# Altium schematic sheet MCU.SchDoc: MCU
size A3; Organization: ORGANIZATION; Address1: ADDRESS 1; Address2: ADDRESS 2; Address3: ADDRESS 3; Address4: ADDRESS 4; Revision: -; SheetNumber: 3; SheetTotal: 11; ENG_APP_DATE: --/--/--; DSN_APP_DATE: --/--/--; CHK_APP_DATE: --/--/--
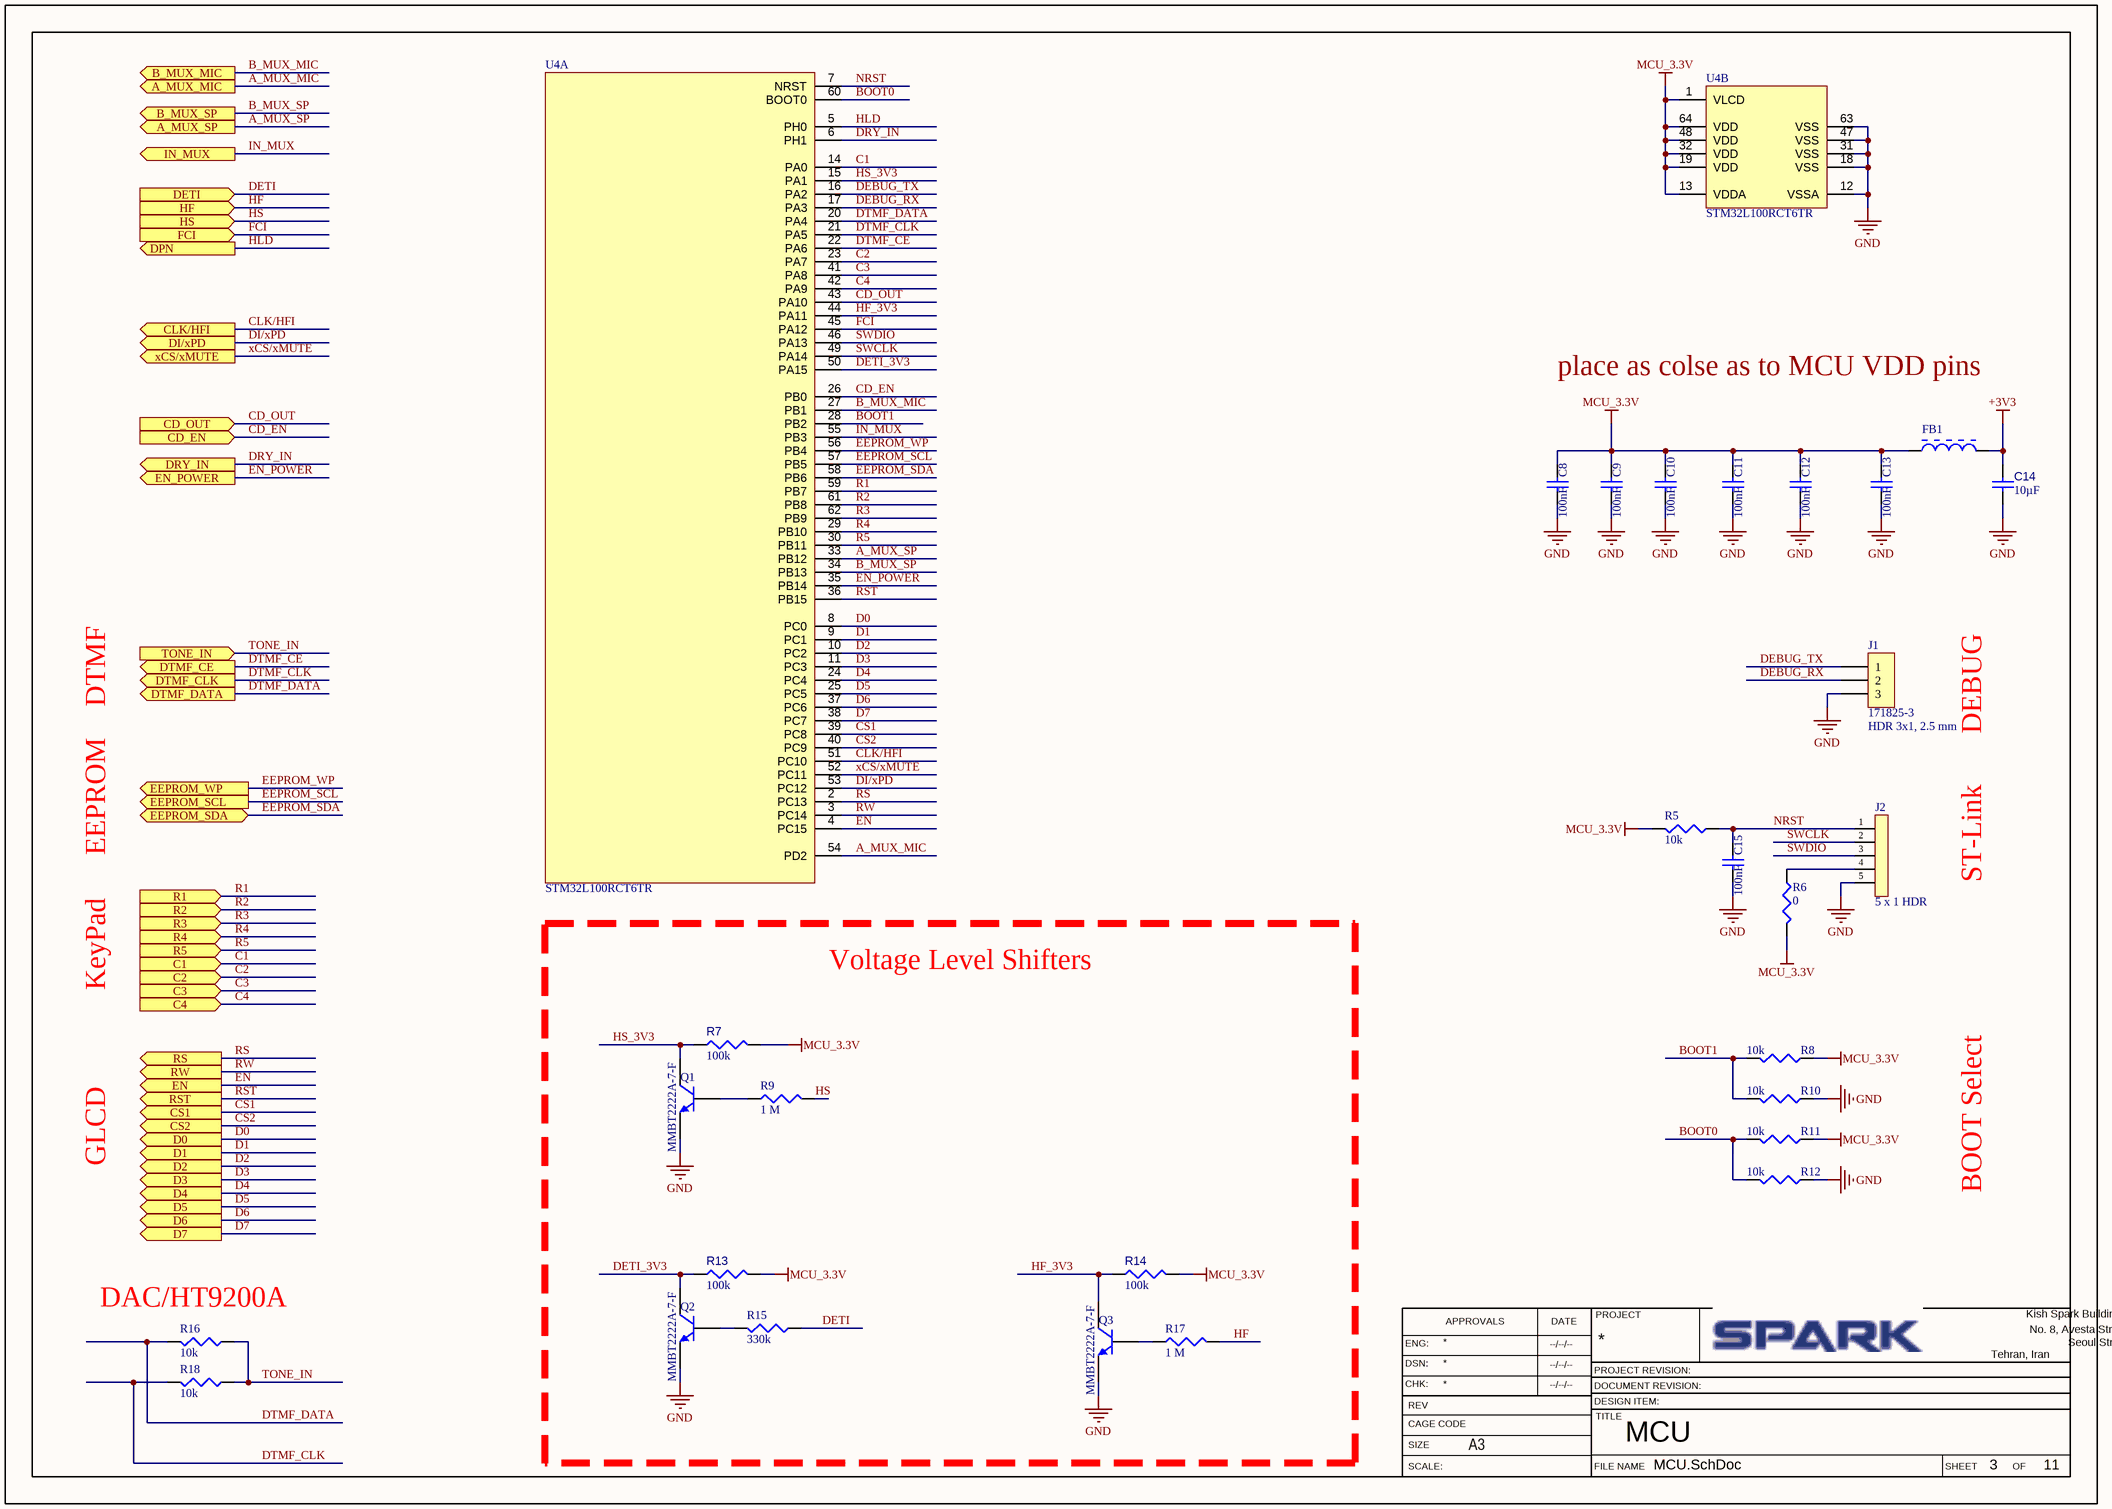
[diagram p0: MCU.SchDoc]

## Parts
C8  value 100nF  [C0603]  (hidden comment: CC0603KRX7R8BB104)
C9  value 100nF  [C0603]  (hidden comment: CC0603KRX7R8BB104)
C10  value 100nF  [C0603]  (hidden comment: CC0603KRX7R8BB104)
C11  value 100nF  [C0603]  (hidden comment: CC0603KRX7R8BB104)
C12  value 100nF  [C0603]  (hidden comment: CC0603KRX7R8BB104)
C13  value 100nF  [C0603]  (hidden comment: CC0603KRX7R8BB104)
C14  value 10µF  [0805]  (hidden comment: C0805C106K9PACTU)
C15  value 100nF  [C0603]  (hidden comment: CC0603KRX7R8BB104)
FB1  CMP-006-00051-1  [R0603]  (value not drawn)
J1  171825-3  value HDR 3x1, 2.5 mm  [HDR_MALE_1x3_2.5MM_AMP EI_VERT]
J2  5 x 1 HDR  [HDR_male_1x5_2.54mm]
Q1  MMBT2222A-7-F  [SOT23127P600-8N]
Q2  MMBT2222A-7-F  [SOT23127P600-8N]
Q3  MMBT2222A-7-F  [SOT23127P600-8N]
R5  value 10k  [R0603]  (hidden comment: CRCW060310K0JNEA)
R6  value 0  [0805]  (hidden comment: CMP-009-00305-1)
R7  value 100k  [R0805]  (hidden comment: RC0805FR-07100KL)
R8  value 10k  [R0603]  (hidden comment: CRCW060310K0JNEA)
R9  value 1 M  [0805]  (hidden comment: CMP-009-00300-1)
R10  value 10k  [R0603]  (hidden comment: CRCW060310K0JNEA)
R11  value 10k  [R0603]  (hidden comment: CRCW060310K0JNEA)
R12  value 10k  [R0603]  (hidden comment: CRCW060310K0JNEA)
R13  value 100k  [R0805]  (hidden comment: RC0805FR-07100KL)
R14  value 100k  [R0805]  (hidden comment: RC0805FR-07100KL)
R15  value 330k  [0805]  (hidden comment: CMP-009-00308-1)
R16  value 10k  [R0603]  (hidden comment: CRCW060310K0JNEA)
R17  value 1 M  [0805]  (hidden comment: CMP-009-00300-1)
R18  value 10k  [R0603]  (hidden comment: CRCW060310K0JNEA)
U4  STM32L100RCT6TR  [STM32L100RCT6TR-Footprint-1]  (parts A,B of 2)

## Blocks framed on the sheet
Voltage Level Shifters: Q1-Q3 R7 R9 R13-R15 R17

## Ports
A_MUX_MIC (out), A_MUX_SP (out), B_MUX_MIC (out), B_MUX_SP (out), C1 (in), C2 (in), C3 (in), C4 (in), CD_EN (in), CD_OUT (in), CLK/HFI (out), CS1 (out), CS2 (out), D0 (out), D1 (out), D2 (out), D3 (out), D4 (out), D5 (out), D6 (out), D7 (out), DETI (in), DI/xPD (out), DPN (out), DRY_IN (out), DTMF_CE (out), DTMF_CLK (out), DTMF_DATA (out), EEPROM_SCL (out), EEPROM_SDA (bidir), EEPROM_WP (out), EN (out), EN_POWER (out), FCI (in), HF (in), HS (in), IN_MUX (out), R1 (in), R2 (in), R3 (in), R4 (in), R5 (in), RS (out), RST (out), RW (out), TONE_IN (in), xCS/xMUTE (out)

## Nets
+3V3: C14.1 FB1.2
GND: C8.2 C9.2 C10.2 C11.2 C12.2 C13.2 C14.2 C15.2 J1.3 J2.5 Q1.1(E) Q2.1(E) Q3.1(E) R10.1 R12.1 U4.12(VSSA) U4.18(VSS) U4.31(VSS) U4.47(VSS) U4.63(VSS)
MCU_3.3V: C8.1 C9.1 C10.1 C11.1 C12.1 C13.1 FB1.1 R5.2 R6.2 R7.2 R8.1 R11.1 R13.2 R14.2 U4.1(VLCD) U4.13(VDDA) U4.19(VDD) U4.32(VDD) U4.48(VDD) U4.64(VDD)
A_MUX_MIC: U4.54(PD2) ; port A_MUX_MIC
A_MUX_SP: U4.33(PB12) ; port A_MUX_SP
B_MUX_MIC: U4.27(PB1) ; port B_MUX_MIC
B_MUX_SP: U4.34(PB13) ; port B_MUX_SP
BOOT0: R11.2 R12.2 U4.60(BOOT0)
BOOT1: R8.2 R10.2 U4.28(PB2)
C1: U4.14(PA0) ; port C1
C2: U4.23(PA7) ; port C2
C3: U4.41(PA8) ; port C3
C4: U4.42(PA9) ; port C4
CD_EN: U4.26(PB0) ; port CD_EN
CD_OUT: U4.43(PA10) ; port CD_OUT
CLK/HFI: U4.51(PC10) ; port CLK/HFI
CS1: U4.39(PC8) ; port CS1
CS2: U4.40(PC9) ; port CS2
D0: U4.8(PC0) ; port D0
D1: U4.9(PC1) ; port D1
D2: U4.10(PC2) ; port D2
D3: U4.11(PC3) ; port D3
D4: U4.24(PC4) ; port D4
D5: U4.25(PC5) ; port D5
D6: U4.37(PC6) ; port D6
D7: U4.38(PC7) ; port D7
DEBUG_RX: J1.2 U4.17(PA3)
DEBUG_TX: J1.1 U4.16(PA2)
DETI: R15.1 ; port DETI
DETI_3V3: Q2.3(C) R13.1 U4.50(PA15)
DI/xPD: U4.53(PC12) ; port DI/xPD
DRY_IN: U4.6(PH1) ; port DRY_IN
DTMF_CE: U4.22(PA6) ; port DTMF_CE
DTMF_CLK: R18.2 U4.21(PA5) ; port DTMF_CLK
DTMF_DATA: R16.2 U4.20(PA4) ; port DTMF_DATA
EEPROM_SCL: U4.57(PB5) ; port EEPROM_SCL
EEPROM_SDA: U4.58(PB6) ; port EEPROM_SDA
EEPROM_WP: U4.56(PB4) ; port EEPROM_WP
EN: U4.4(PC15) ; port EN
EN_POWER: U4.35(PB14) ; port EN_POWER
FCI: U4.45(PA12) ; port FCI
HF: R17.2 ; port HF
HF_3V3: Q3.3(C) R14.1 U4.44(PA11)
HLD: U4.5(PH0) ; port DPN
HS: R9.2 ; port HS
HS_3V3: Q1.3(C) R7.1 U4.15(PA1)
IN_MUX: U4.55(PB3) ; port IN_MUX
NRST: C15.1 J2.1 R5.1 U4.7(NRST)
R1: U4.59(PB7) ; port R1
R2: U4.61(PB8) ; port R2
R3: U4.62(PB9) ; port R3
R4: U4.29(PB10) ; port R4
R5: U4.30(PB11) ; port R5
RS: U4.2(PC13) ; port RS
RST: U4.36(PB15) ; port RST
RW: U4.3(PC14) ; port RW
SWCLK: J2.2 U4.49(PA14)
SWDIO: J2.3 U4.46(PA13)
TONE_IN: R16.1 R18.1 ; port TONE_IN
xCS/xMUTE: U4.52(PC11) ; port xCS/xMUTE
NetJ2_4: J2.4 R6.1
NetQ1_2: Q1.2(B) R9.1
NetQ2_2: Q2.2(B) R15.2
NetQ3_2: Q3.2(B) R17.1

## Notes on the sheet
- place as colse as to MCU VDD pins
- DTMF
- DEBUG
- EEPROM
- ST-Link
- KeyPad
- GLCD
- BOOT Select
- (near R16) DAC/HT9200A
- APPROVALS
- DATE
- PROJECT
- Kish Spark Building
- No. 8, Avesta Street
- ENG:
- DSN:
- CHK:
- PROJECT REVISION:
- DESIGN ITEM:
- DOCUMENT REVISION:
- Tehran, Iran
- Seoul Street, Sheikh Bahaie
- SIZE
- REV
- SCALE:
- CAGE CODE
- A3
- FILE NAME
- TITLE
- SHEET
- OF

## Library data of the parts
C8-C13 C15 = CMP-001-00108-2: YAGEO - CC0603KRX7R8BB104 - CERAMIC CAPACITOR, 0.1UF, 25V, X7R, 10%, 0603, FULL REEL; Case/Package: 0603; Pins: 2; RoHS Compliant: Yes; Min Operating Temperature: -55°C; Max Operating Temperature: 125°C; Voltage Rating: 25V; Tolerance: 10%; Design Item ID: CC0603KRX7R8BB104; Case Code (Metric): 1608; Category: Ceramic Capacitors; Depth: 0.8mm; Dielectric: X7R; Halogen Free: Halogen Free; Height: 0.8mm; Lead Free: Lead Free; Length: 1.6mm; Manufacturer 1: Yageo; Manufacturer Part Number 1: CC0603KRX7R8BB104; Mount: Surface Mount; Package Quantity: 1; Packaging: Tape and Reel; Pricing 1: 1=0.10000, 10=0.05000, 50=0.02720, 100=0.02220, 500=0.01586, 1000=0.01246 (USD); Radiation Hardening: No; REACH SVHC: Unknown; Resistor Type: Ceramic; RoHS: Yes; Series: CC; Source: PTZLib.SchLib; Stock 1: 4053185; Termination: SMD/SMT; Thickness: 0.035inch; Voltage: 25V; Voltage Rating (DC): 25V; Width: 0.8mm; ComponentLink1Description: https://datasheet.ciiva.com/144/mlccorderingcode-144075.pdf?src-supplier=Digi-Key; ComponentLink1URL: https://datasheet.ciiva.com/144/mlccorderingcode-144075.pdf?src-supplier=Digi-Key; ComponentLink2Description: https://datasheet.ciiva.com/11786/0900766b80c10176-11786120.pdf?src-supplier=RSComponents; ComponentLink2URL: https://datasheet.ciiva.com/11786/0900766b80c10176-11786120.pdf?src-supplier=RSComponents; ComponentLink3Description: https://datasheet.ciiva.com/7978/1489800-7978155.pdf?src-supplier=Element14; ComponentLink3URL: https://datasheet.ciiva.com/7978/1489800-7978155.pdf?src-supplier=Element14; ComponentLink4Description: https://datasheet.ciiva.com/28450/1489800-28450584.pdf?src-supplier=Element14; ComponentLink4URL: https://datasheet.ciiva.com/28450/1489800-28450584.pdf?src-supplier=Element14; ComponentLink5Description: https://datasheet.ciiva.com/144/mlccorderingcode-144074.pdf?src-supplier=Digi-Key; ComponentLink5URL: https://datasheet.ciiva.com/144/mlccorderingcode-144074.pdf?src-supplier=Digi-Key; ComponentLink6Description: https://datasheet.ciiva.com/144/mlccorderingcode-144073.pdf?src-supplier=Digi-Key; ComponentLink6URL: https://datasheet.ciiva.com/144/mlccorderingcode-144073.pdf?src-supplier=Digi-Key; ComponentLink7Description: https://datasheet.ciiva.com/13389/upy-gphc-x7r-6-3v-to-50v-8-13389352.pdf?src-supplier=Mouser; ComponentLink7URL: https://datasheet.ciiva.com/13389/upy-gphc-x7r-6-3v-to-50v-8-13389352.pdf?src-supplier=Mouser; ComponentLink8Description: https://datasheet.ciiva.com/11587/upy-gphc-x7r-6-3v-to-50v-8-11587208.pdf?src-supplier=Avnet; ComponentLink8URL: https://datasheet.ciiva.com/11587/upy-gphc-x7r-6-3v-to-50v-8-11587208.pdf?src-supplier=Avnet; ComponentLink9Description: https://datasheet.ciiva.com/26829/getdatasheetpartid-403577-26829431.pdf?src-supplier=Verical; ComponentLink9URL: https://datasheet.ciiva.com/26829/getdatasheetpartid-403577-26829431.pdf?src-supplier=Verical; ComponentLink10Description: https://datasheet.ciiva.com/17434/upy-gphc-x7r-6-3v-to-50v-8-17434263.pdf?src-supplier=Avnet+Europe; ComponentLink10URL: https://datasheet.ciiva.com/17434/upy-gphc-x7r-6-3v-to-50v-8-17434263.pdf?src-supplier=Avnet+Europe
C14 = CMP-001-00180-2: Ceramic Capacitor, 10UF, 6.3V, X5R, 10%, 0805, Full Reel; Manufacturer: KEMET; Dissipation Factor: 5%; Capacitor Type: Ceramic Capacitors; Manufacturer Part Number: C0805C106K9PACTU; Mount: Surface Mount; Case/Package: 0805; Case Code (Metric): 2012; Dielectric Material: Ceramic; Contact Material: Tin; Min Operating Temperature: -55°C; Max Operating Temperature: 85°C; Tolerance: 10%; Voltage Rating (DC): 6.3V; Dielectric: X5R; Packaging: Tape and Reel; Voltage Rating: 6.3V; Series: SMD Comm X5R; Construction: Flat; Length: 2mm; Width: 1.2mm; Height: 1.25mm; Depth: 1.25mm; Lead Pitch: 0.75mm; Radiation Hardening: No; RoHS Compliant: Yes; Lead Free: Lead Free; Reach SVHC Compliant: No; ComponentLink1URL: https://datasheet.ciiva.com/7842/kem-c1006-x5r-smd-7842200.pdf?src-supplier=Element14; ComponentLink1Description: https://datasheet.ciiva.com/7842/kem-c1006-x5r-smd-7842200.pdf?src-supplier=Element14; ComponentLink2URL: https://datasheet.ciiva.com/7842/kem-c1006-x5r-smd-7842201.pdf?src-supplier=Element14; ComponentLink2Description: https://datasheet.ciiva.com/7842/kem-c1006-x5r-smd-7842201.pdf?src-supplier=Element14; ComponentLink3URL: https://datasheet.ciiva.com/7842/40889-7842553.pdf?src-supplier=Element14; ComponentLink3Description: https://datasheet.ciiva.com/7842/40889-7842553.pdf?src-supplier=Element14; ComponentLink4URL: https://datasheet.ciiva.com/7842/40889-7842554.pdf?src-supplier=Element14; ComponentLink4Description: https://datasheet.ciiva.com/7842/40889-7842554.pdf?src-supplier=Element14; ComponentLink5URL: https://datasheet.ciiva.com/18193/getdatasheetpartid-320652-18193500.pdf?src-supplier=Verical; ComponentLink5Description: https://datasheet.ciiva.com/18193/getdatasheetpartid-320652-18193500.pdf?src-supplier=Verical; Pins: 2; Mounting Technology: SMD/SMT
FB1 = CMP-006-00051-1: Ferrite Beads 0603 60ohm; Manufacturer 1: Murata; Manufacturer Part Number 1: BLM18PG471SN1B; Tolerance: 25%; Impedance: 470R; DC Resistance (DCR): 200mR; Current Rating: 1A; RoHS: Yes; Category: Ferrite Beads and Chips; Case/Package: 0603; Min Operating Temperature: -55°C; Max Operating Temperature: 125°C; Package Quantity: 1000; Packaging: Bulk; ComponentLink1URL: http://www.mouser.com/ds/2/281/c31e-794748.pdf?src-supplier=Mouser; ComponentLink1Description: http://www.mouser.com/ds/2/281/c31e-794748.pdf?src-supplier=Mouser; Pins: 2; Design Item ID: BLM18PG471SN1B; Source: PTZLib.SchLib
J1 = CMP-002-00072-2: EI Series 3 Position 2.5 mm Single Row Through Hole Shrouded Header; Manufacturer: TE Connectivity; Connector Type: Plug,Header,Pin; Voltage Rating: 350V; Approvals: UL; Backwall/Post Interruptions: No (Without); Contact Current Rating: 3.5A; Contact Resistance: 20mR; Mating Alignment: Yes (With); Max Voltage Rating (AC): 250V; Max Voltage Rating (DC): 350.25kV; Number of Contacts: 3; PCB Mount Retention: Without; PCB Mounting Orientation: Vertical; PCB Thickness: 0.063inch; Pitch: 2.5mm; Plating Thickness: 0.8um; Tail Length: 0.142inch; Case/Package: 1000; RoHS Compliant: Yes; Min Operating Temperature: -20°C; Max Operating Temperature: 95°C; Design Item ID: 171825-3; Category: Connectors; Color: Natural; Contact Gender: Male; Contact Material: Brass; Contact Mating Length: 7.5mm; Contact Plating: Copper,Tin; Contact Retention: No (Without); Contact Shape: Square; Contact Type: Male Pin; Current Rating: 3.5A; Depth: 4.9mm; Flammability Rating: UL94 V-0; Height: 0.409inch; Housing Color: Natural; Housing Material: Nylon; Insulation Material: Polyamide; Length: 7.5mm; Manufacturer Part Number: 171825-3; Mating Retention: Yes (With); Number of Positions: 3; Number of Rows: 1; Orientation: Straight; Packaging: Bag; PCB Mount Alignment: No (Without); Pricing 1: 1=0.26000, 10=0.21300, 50=0.21300, 100=0.16500, 500=0.15000, 1000=0.12400, 2000=0.11300, 5000=0.10600, 10000=0.09900, 25000=0.09300 (USD); REACH SVHC: No SVHC; RoHS: Yes; Series: EI; Strain Relief: No (Without); Termination: Solder; Width: 14mm; ComponentLink1Description: https://datasheet.ciiva.com/15175/getdatasheetpartid-40634-15175588.pdf?src-supplier=Verical; ComponentLink1URL: https://datasheet.ciiva.com/15175/getdatasheetpartid-40634-15175588.pdf?src-supplier=Verical; ComponentLink2Description: https://datasheet.ciiva.com/19461/1963001-19461179.pdf?src-supplier=Jameco; ComponentLink2URL: https://datasheet.ciiva.com/19461/1963001-19461179.pdf?src-supplier=Jameco; ComponentLink3Description: https://datasheet.ciiva.com/11750/0900766b80ed54cb-11750348.pdf?src-supplier=RSComponents; ComponentLink3URL: https://datasheet.ciiva.com/11750/0900766b80ed54cb-11750348.pdf?src-supplier=RSComponents; ComponentLink4Description: https://datasheet.ciiva.com/30247/eng-cat-1242174-0698-8-30247015.pdf?src-supplier=Onlinecomponents.com; ComponentLink4URL: https://datasheet.ciiva.com/30247/eng-cat-1242174-0698-8-30247015.pdf?src-supplier=Onlinecomponents.com; ComponentLink5Description: https://datasheet.ciiva.com/6857/eng-cd-171825-y2-171825-c-6857228.pdf?src-supplier=Digi-Key; ComponentLink5URL: https://datasheet.ciiva.com/6857/eng-cd-171825-y2-171825-c-6857228.pdf?src-supplier=Digi-Key; Mounting Technology: Through Hole; Pins: 3
J2 = CMP-017-000010-1: Manufacturer Part # :   9-146278-0; Design Item ID: 5 x 1 HDR; Source: PTZLib.SchLib
Q1-Q3 = CMP-012-00003-2: MMBT2222 Series NPN 350 mW 40 V 600 mA SMT Small Signal Transistor - SOT-23; Manufacturer: Diodes; Current Rating: 600mA; Voltage Rating: 40V; Collector Base Voltage (VCBO): 75V; Collector Emitter Saturation Voltage: 1V; Current: 1A; Element Configuration: Single; Emitter Base Voltage (VEBO): 6V; Frequency: 300MHz; hFE Min: 100; Max Power Dissipation: 300mW; Number of Elements: 1; Power Dissipation: 350mW; Case/Package: SOT-23-3; Pins: 3; RoHS Compliant: Yes; Min Operating Temperature: -55°C; Max Operating Temperature: 150°C; Design Item ID: MMBT2222A-7-F; Category: BJTs; Collector Emitter Breakdown Voltage: 40V; Collector Emitter Voltage (VCEO): 40V; Collector-emitter Voltage-Max: 1V; Component Type: Standard; Contact Plating: Tin,Matte; Continuous Collector Current: 600mA; Gain Bandwidth Product: 300MHz; Height: 1mm; Lead Free: Lead Free; Length: 3.05mm; Manufacturer Part Number: MMBT2222A-7-F; Max Collector Current: 600mA; Max Frequency: 300MHz; Mount: Surface Mount; Package Quantity: 3000; Packaging: Tape and Reel; Pin Count: 3; Polarity: NPN; Pricing 1: 1=0.14000, 10=0.13300, 50=0.13300, 100=0.07200, 500=0.04500, 1000=0.03100, 3000=0.02300, 9000=0.02000, 10000=0.02000, 24000=0.01800, 45000=0.01500 (USD); Radiation Hardening: No; Reach SVHC Compliant: Yes; RoHS: Yes; Series: Automotive, AEC-Q101; Source: PTZ.SCHLIB; Stock 1: 1743698; Termination: SMD/SMT; Transition Frequency: 300MHz; Voltage: 40V; Voltage Rating (DC): 40V; Weight: 0.000282oz; Width: 1.4mm; ComponentLink1Description: https://datasheet.ciiva.com/15139/getdatasheetpartid-82692-15139078.pdf?src-supplier=Verical; ComponentLink1URL: https://datasheet.ciiva.com/15139/getdatasheetpartid-82692-15139078.pdf?src-supplier=Verical; ComponentLink2Description: https://datasheet.ciiva.com/8029/ds30041-8029709.pdf?src-supplier=Element14; ComponentLink2URL: https://datasheet.ciiva.com/8029/ds30041-8029709.pdf?src-supplier=Element14; ComponentLink3Description: https://datasheet.ciiva.com/11201/ds30041-11201864.pdf?src-supplier=Avnet; ComponentLink3URL: https://datasheet.ciiva.com/11201/ds30041-11201864.pdf?src-supplier=Avnet; ComponentLink4Description: https://datasheet.ciiva.com/16199/ds30041-16199045.pdf?src-supplier=Future+Electronics; ComponentLink4URL: https://datasheet.ciiva.com/16199/ds30041-16199045.pdf?src-supplier=Future+Electronics; ComponentLink5Description: https://datasheet.ciiva.com/11198/ds30041-11198965.pdf?src-supplier=Avnet; ComponentLink5URL: https://datasheet.ciiva.com/11198/ds30041-11198965.pdf?src-supplier=Avnet; ComponentLink6Description: https://datasheet.ciiva.com/972/ds30041-972551.pdf?src-supplier=Digi-Key; ComponentLink6URL: https://datasheet.ciiva.com/972/ds30041-972551.pdf?src-supplier=Digi-Key; ComponentLink7Description: https://datasheet.ciiva.com/972/ds30041-972552.pdf?src-supplier=Digi-Key; ComponentLink7URL: https://datasheet.ciiva.com/972/ds30041-972552.pdf?src-supplier=Digi-Key; ComponentLink8Description: https://datasheet.ciiva.com/972/ds30041-972550.pdf?src-supplier=Digi-Key; ComponentLink8URL: https://datasheet.ciiva.com/972/ds30041-972550.pdf?src-supplier=Digi-Key
R5 R8 R10-R12 R16 R18 = CMP-009-00213-1: Res Thick Film 0603 10K Ohm 5% 1/10W 200ppm/C Molded SMD SMD Paper T/R; Manufacturer 1: Vishay Dale; Voltage Rating: 75V; Max Power Dissipation: 100mW; Temperature Coefficient: 200ppm/°C; Case/Package: 0603; Pins: 2; RoHS Compliant: Yes; Min Operating Temperature: -55°C; Max Operating Temperature: 155°C; Tolerance: 5%; Design Item ID: CRCW060310K0JNEA; Case Code (Metric): 1608; Category: Chip SMD Resistors; Construction: Rectangular; Contact Plating: Tin; Depth: 0.85mm; Features: Automotive AEC-Q200; Height: 0.02inch; Lead Free: Lead Free; Length: 1.55mm; Manufacturer Part Number 1: CRCW060310K0JNEA; Military Standard: Not; Mount: Surface Mount; Number of Terminations: 2; Package Quantity: 1; Packaging: Tape and Reel; Power Rating: 100mW; Pricing 1: 1=0.10000, 10=0.03300, 100=0.01360, 1000=0.00610, 2500=0.00529 (USD); Radiation Hardening: No; REACH SVHC: Unknown; Resistance Tolerance: 5%; Resistor Type: Thick Film; RoHS: Yes; Series: CRCW; Size Code: 0603; Source: PTZLib.SchLib; Stock 1: 41; Termination: SMD/SMT; Voltage Rating (DC): 75V; Weight: 7.1E-05oz; Width: 0.033inch; ComponentLink1Description: https://datasheet.ciiva.com/3256/dcrcwe3-3256943.pdf?src-supplier=Avnet; ComponentLink1URL: https://datasheet.ciiva.com/3256/dcrcwe3-3256943.pdf?src-supplier=Avnet; ComponentLink2Description: https://datasheet.ciiva.com/2461/dcrcwe3-2461971.pdf?src-supplier=Digi-Key; ComponentLink2URL: https://datasheet.ciiva.com/2461/dcrcwe3-2461971.pdf?src-supplier=Digi-Key; ComponentLink3Description: https://datasheet.ciiva.com/2461/dcrcwe3-2461972.pdf?src-supplier=Digi-Key; ComponentLink3URL: https://datasheet.ciiva.com/2461/dcrcwe3-2461972.pdf?src-supplier=Digi-Key; ComponentLink4Description: https://datasheet.ciiva.com/2461/dcrcwe3-2461973.pdf?src-supplier=Digi-Key; ComponentLink4URL: https://datasheet.ciiva.com/2461/dcrcwe3-2461973.pdf?src-supplier=Digi-Key; ComponentLink5Description: https://datasheet.ciiva.com/3256/dcrcwe3-3256942.pdf?src-supplier=Avnet; ComponentLink5URL: https://datasheet.ciiva.com/3256/dcrcwe3-3256942.pdf?src-supplier=Avnet; ComponentLink6Description: https://datasheet.ciiva.com/16343/dcrcwe3-16343525.pdf?src-supplier=Future+Electronics; ComponentLink6URL: https://datasheet.ciiva.com/16343/dcrcwe3-16343525.pdf?src-supplier=Future+Electronics; ComponentLink7Description: https://datasheet.ciiva.com/16755/70201119-16755717.pdf?src-supplier=Allied+Electronics; ComponentLink7URL: https://datasheet.ciiva.com/16755/70201119-16755717.pdf?src-supplier=Allied+Electronics; ComponentLink8Description: https://datasheet.ciiva.com/16515/dcrcwe3-16515020.pdf?src-supplier=Avnet+Asia; ComponentLink8URL: https://datasheet.ciiva.com/16515/dcrcwe3-16515020.pdf?src-supplier=Avnet+Asia; ComponentLink9Description: https://datasheet.ciiva.com/16771/70201119-16771051.pdf?src-supplier=Allied+Electronics; ComponentLink9URL: https://datasheet.ciiva.com/16771/70201119-16771051.pdf?src-supplier=Allied+Electronics
R6 = CMP-009-00305-1: RC Series 0805 0.125 W 0 Ohm Jumper SMT Thick Film Chip Resistor; Manufacturer: Yageo; Manufacturer Part Number: RC0805FR-070RL; Tolerance: 1%; Power Rating: 125mW; RoHS: Yes; Category: Chip SMD Resistors; Stock 1: 550673; Pricing 1: 1=0.1, 10=0.039, 50=0.039, 100=0.016, 1000=0.008, 10000=0.004 (USD); Case/Package: 0805; Contact Plating: Tin,Matte; Case Code (Metric): 2012; Size Code: 0805; Min Operating Temperature: -55°C; Max Operating Temperature: 155°C; Packaging: Tape and Reel; Features: Moisture Resistant; Series: RC; Max Power Dissipation: 125mW; Number of Terminations: 2; Construction: Rectangular; Length: 2mm; Depth: 1.25mm; Military Standard: Not; Lead Free: Lead Free; RoHS Compliant: Yes; ComponentLink1URL: https://datasheet.ciiva.com/15189/getdatasheetpartid-348154-15189885.pdf?src-supplier=Verical; ComponentLink1Description: https://datasheet.ciiva.com/15189/getdatasheetpartid-348154-15189885.pdf?src-supplier=Verical; ComponentLink2URL: https://datasheet.ciiva.com/17042/rc0805-17042698.pdf?src-supplier=Future+Electronics; ComponentLink2Description: https://datasheet.ciiva.com/17042/rc0805-17042698.pdf?src-supplier=Future+Electronics; Design Item ID: RC0805FR-070RL; Component Type: Standard; Pin Count: 2; Source: V4-TEL.SCHLIB
R7 R13 R14 = CMP-009-00322-1: Res Thick Film 0805 100K Ohm 1% 1/8W ±100ppm/°C Molded SMD Paper T/R; Manufacturer: Yageo; Power: 125mW; Voltage Rating: 150V; Case/Package: 0805; Pins: 2; RoHS Compliant: True; Mounting Technology: SM; Tolerance: 1%; Max Operating Temperature: 155°C; Min Operating Temperature: -55°C; Contact Plating: Tin,Matte; Height: 500um; Lead Free: Lead Free; Length: 2mm; Packaging: Cut Tape; Radiation Hardening: No; Reach SVHC Compliant: Yes; Resistor Type: Thick Film; Temperature Coefficient: 100ppm/°C; Voltage Rating (DC): 150V; Width: 1.25mm; Manufacturer Part Number: RC0805FR-07100KL
R9 R17 = CMP-009-00300-1: Res Thick Film 0805 1M Ohm 5% 0.125W(1/8W) ±200ppm/°C Pad SMD T/R; Manufacturer: Vishay; Manufacturer Part Number: CRCW08051M00JNEAC; RoHS: No; Category: Chip SMD Resistors; Stock 1: 24891; Pricing 1: 1=0.1, 10=0.042, 50=0.042, 100=0.017, 1000=0.008, 10000=0.005 (USD); Design Item ID: CRCW08051M00JNEAC; Component Type: Standard; Pin Count: 2; Source: V4-TEL.SCHLIB
R15 = CMP-009-00308-1: Res Thick Film 0805 330K Ohm 1% 1/8W ±100ppm/°C Molded SMD Paper T/R; Manufacturer: Yageo; Manufacturer Part Number: RC0805FR-07330KL; Power Rating: 125mW; Voltage Rating: 150V; RoHS: Yes; Category: Chip SMD Resistors; Stock 1: 220926; Pricing 1: 1=0.1, 10=0.033, 50=0.033, 100=0.014, 1000=0.007, 10000=0.003 (USD); Case/Package: 0805; Case Code (Metric): 2012; Contact Plating: Tin,Matte; Size Code: 0805; Min Operating Temperature: -55°C; Max Operating Temperature: 155°C; Tolerance: 1%; Package Quantity: 1; Packaging: Tape and Reel; Resistor Type: Thick Film; Number of Terminations: 2; Termination: SMD/SMT; Temperature Coefficient: 100ppm/°C; Max Power Dissipation: 125mW; Features: Moisture Resistant; Series: RC; Resistance Tolerance: 1%; Construction: Rectangular; Technology: THICK FILM; Length: 0.079inch; Width: 0.049inch; Height: 0.024inch; Depth: 1.25mm; Military Standard: Not; Lead Free: Lead Free; RoHS Compliant: Yes; Reach SVHC Compliant: Unknown; ComponentLink1URL: https://datasheet.ciiva.com/2457/pyu-r-int-thick-7-2457090.pdf?src-supplier=Digi-Key; ComponentLink1Description: https://datasheet.ciiva.com/2457/pyu-r-int-thick-7-2457090.pdf?src-supplier=Digi-Key; ComponentLink2URL: https://datasheet.ciiva.com/2457/pyu-r-int-thick-7-2457091.pdf?src-supplier=Digi-Key; ComponentLink2Description: https://datasheet.ciiva.com/2457/pyu-r-int-thick-7-2457091.pdf?src-supplier=Digi-Key; ComponentLink3URL: https://datasheet.ciiva.com/2457/pyu-r-int-thick-7-2457089.pdf?src-supplier=Digi-Key; ComponentLink3Description: https://datasheet.ciiva.com/2457/pyu-r-int-thick-7-2457089.pdf?src-supplier=Digi-Key; ComponentLink4URL: https://datasheet.ciiva.com/12667/rc0805-12667006.pdf?src-supplier=Mouser; ComponentLink4Description: https://datasheet.ciiva.com/12667/rc0805-12667006.pdf?src-supplier=Mouser; ComponentLink5URL: https://datasheet.ciiva.com/7941/444164-7941766.pdf?src-supplier=Element14; ComponentLink5Description: https://datasheet.ciiva.com/7941/444164-7941766.pdf?src-supplier=Element14; ComponentLink6URL: https://datasheet.ciiva.com/7941/444164-7941767.pdf?src-supplier=Element14; ComponentLink6Description: https://datasheet.ciiva.com/7941/444164-7941767.pdf?src-supplier=Element14; ComponentLink7URL: https://datasheet.ciiva.com/17197/rc0805-17197631.pdf?src-supplier=Future+Electronics; ComponentLink7Description: https://datasheet.ciiva.com/17197/rc0805-17197631.pdf?src-supplier=Future+Electronics; Design Item ID: RC0805FR-07330KL; Component Type: Standard; Pin Count: 2; Source: V4-TEL.SCHLIB
U4 = CMP-031-00022-4: Ultra-low-power 32-bit Value Line ARM Cortex-M3 MCU with 256 Kbytes Flash, 32 MHz CPU, LCD, USB; Manufacturer: STMicroelectronics; Interface: I2C,SPI,USB,UART,USART; Memory Size: 256KB; Number of I/Os: 51; Oscillator Type: Internal; Peripherals: Brown-out Detect/Reset,POR,PWM,WDT,DMA,LCD; Case/Package: LQFP; RoHS Compliant: Yes; Min Operating Temperature: -40°C; Max Operating Temperature: 85°C; Design Item ID: STM32L100RCT6TR; Category: Microcontrollers; Component Type: Standard; Core Architecture: ARM; Manufacturer Part Number: STM32L100RCT6TR; Memory Format: FLASH; Packaging: Tape and Reel; Series: STM32 L1; ComponentLink1Description: http://www.mouser.com/ds/2/389/stm32l100rc-956221.pdf?src-supplier=Mouser; ComponentLink1URL: http://www.mouser.com/ds/2/389/stm32l100rc-956221.pdf?src-supplier=Mouser; ComponentLink2Description: http://www.st.com/content/ccc/resource/technical/document/datasheet/aa/5b/32/7b/98/10/4f/86/DM00090183.pdf/files/DM00090183.pdf/jcr:content/translations/en.DM00090183.pdf?src-supplier=Digi-Key; ComponentLink2URL: http://www.st.com/content/ccc/resource/technical/document/datasheet/aa/5b/32/7b/98/10/4f/86/DM00090183.pdf/files/DM00090183.pdf/jcr:content/translations/en.DM00090183.pdf?src-supplier=Digi-Key; ComponentLink3Description: http://www.st.com/st-web-ui/static/active/en/resource/technical/document/datasheet/DM00108661.pdf?src-supplier=Avnet; ComponentLink3URL: http://www.st.com/st-web-ui/static/active/en/resource/technical/document/datasheet/DM00108661.pdf?src-supplier=Avnet; Pins: 64